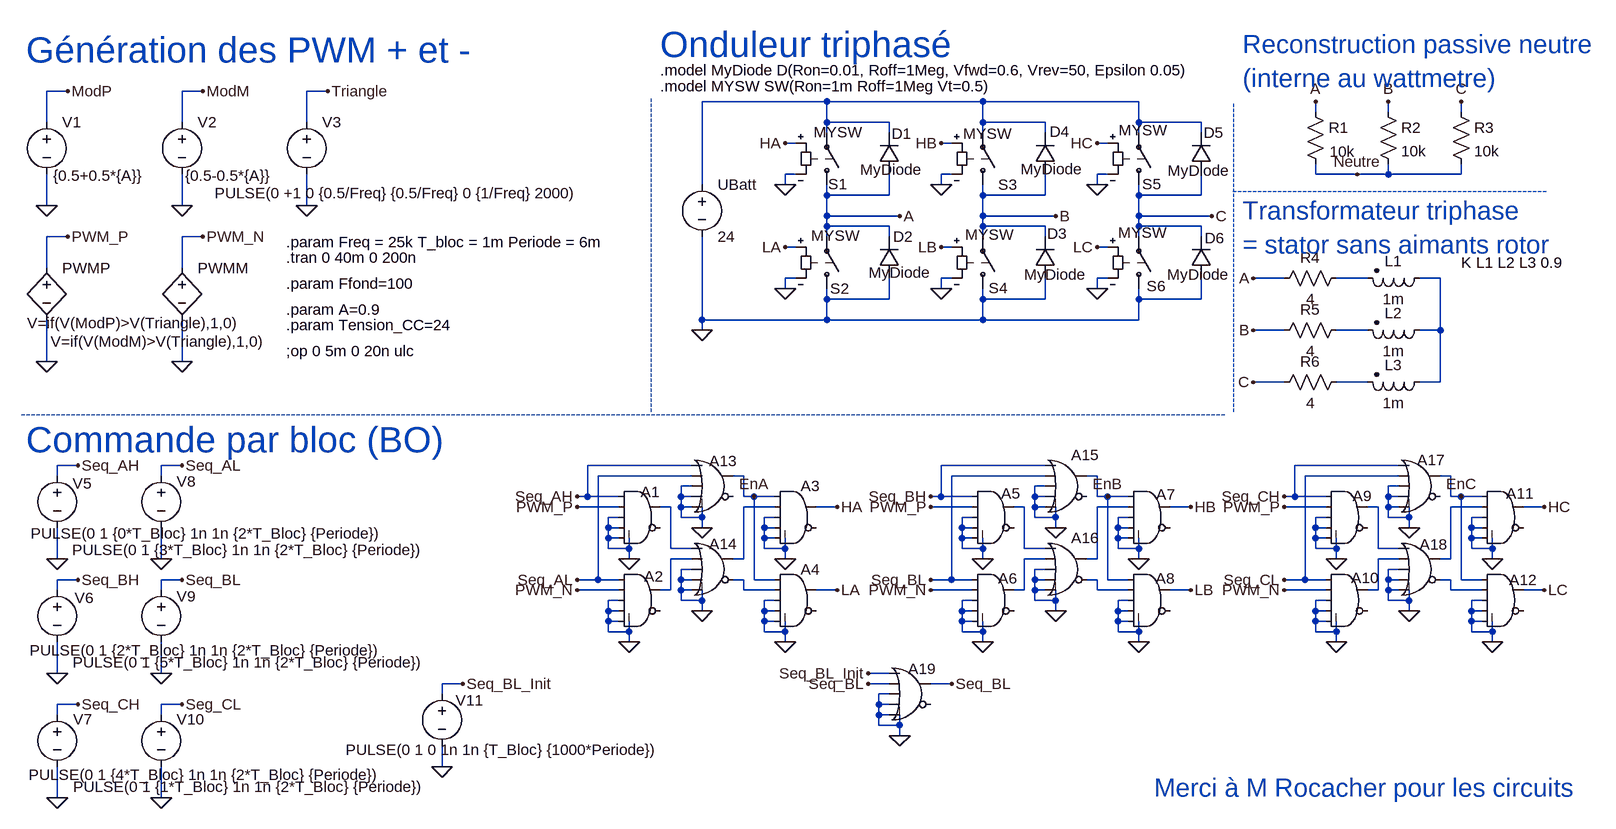
[diagram p0: schematic v1.asc]
v1.asc, the LTspice schematic file:
Version 4
SHEET 1 1408 1276
WIRE -1056 160 -1088 160
WIRE -848 160 -880 160
WIRE -656 160 -688 160
WIRE 112 176 -80 176
WIRE 352 176 112 176
WIRE 592 176 352 176
WIRE 864 192 864 176
WIRE 976 192 976 176
WIRE 1088 192 1088 176
WIRE -1088 208 -1088 160
WIRE -880 208 -880 160
WIRE -688 208 -688 160
WIRE 112 208 112 176
WIRE 208 208 112 208
WIRE 352 208 352 176
WIRE 448 208 352 208
WIRE 592 208 592 176
WIRE 688 208 592 208
WIRE 112 224 112 208
WIRE 208 224 208 208
WIRE 352 224 352 208
WIRE 448 224 448 208
WIRE 592 224 592 208
WIRE 688 224 688 208
WIRE 64 240 48 240
WIRE 304 240 288 240
WIRE 544 240 528 240
WIRE 64 288 48 288
WIRE 304 288 288 288
WIRE 544 288 528 288
WIRE 864 288 864 272
WIRE 928 288 864 288
WIRE 976 288 976 272
WIRE 976 288 928 288
WIRE 1088 288 1088 272
WIRE 1088 288 976 288
WIRE -80 304 -80 176
WIRE 48 304 48 288
WIRE 288 304 288 288
WIRE 528 304 528 288
WIRE 112 320 112 304
WIRE 208 320 208 288
WIRE 208 320 112 320
WIRE 352 320 352 304
WIRE 448 320 448 288
WIRE 448 320 352 320
WIRE 592 320 592 304
WIRE 688 320 688 288
WIRE 688 320 592 320
WIRE -1088 336 -1088 288
WIRE -880 336 -880 288
WIRE -688 336 -688 288
WIRE 112 352 112 320
WIRE 224 352 112 352
WIRE 352 352 352 320
WIRE 464 352 352 352
WIRE 592 352 592 320
WIRE 704 352 592 352
WIRE 112 368 112 352
WIRE 208 368 112 368
WIRE 352 368 352 352
WIRE 448 368 352 368
WIRE 592 368 592 352
WIRE 688 368 592 368
WIRE -1056 384 -1088 384
WIRE -848 384 -880 384
WIRE 112 384 112 368
WIRE 208 384 208 368
WIRE 352 384 352 368
WIRE 448 384 448 368
WIRE 592 384 592 368
WIRE 688 384 688 368
WIRE 64 400 48 400
WIRE 304 400 288 400
WIRE 544 400 528 400
WIRE -1088 432 -1088 384
WIRE -880 432 -880 384
WIRE 64 448 48 448
WIRE 304 448 288 448
WIRE 544 448 528 448
WIRE 816 448 768 448
WIRE 944 448 896 448
WIRE 1056 448 1024 448
WIRE 48 464 48 448
WIRE 288 464 288 448
WIRE 528 464 528 448
WIRE 112 480 112 464
WIRE 208 480 208 448
WIRE 208 480 112 480
WIRE 352 480 352 464
WIRE 448 480 448 448
WIRE 448 480 352 480
WIRE 592 480 592 464
WIRE 688 480 688 448
WIRE 688 480 592 480
WIRE -80 512 -80 384
WIRE 112 512 112 480
WIRE 112 512 -80 512
WIRE 352 512 352 480
WIRE 352 512 112 512
WIRE 592 512 592 480
WIRE 592 512 352 512
WIRE -80 528 -80 512
WIRE 816 528 768 528
WIRE 944 528 896 528
WIRE 1056 528 1056 448
WIRE 1056 528 1024 528
WIRE -1088 576 -1088 512
WIRE -880 576 -880 512
WIRE 816 608 768 608
WIRE 944 608 896 608
WIRE 1056 608 1056 528
WIRE 1056 608 1024 608
WIRE -1040 736 -1072 736
WIRE -880 736 -912 736
WIRE -96 736 -256 736
WIRE 448 736 288 736
WIRE 992 736 832 736
WIRE -1072 752 -1072 736
WIRE -912 752 -912 736
WIRE -96 752 -240 752
WIRE -16 752 -32 752
WIRE 448 752 304 752
WIRE 528 752 512 752
WIRE 992 752 848 752
WIRE 1072 752 1056 752
WIRE -96 768 -112 768
WIRE 448 768 432 768
WIRE 992 768 976 768
WIRE -256 784 -256 736
WIRE -256 784 -272 784
WIRE -208 784 -256 784
WIRE -112 784 -112 768
WIRE -96 784 -112 784
WIRE -16 784 -16 752
WIRE 0 784 -16 784
WIRE 32 784 0 784
WIRE 288 784 288 736
WIRE 288 784 272 784
WIRE 336 784 288 784
WIRE 432 784 432 768
WIRE 448 784 432 784
WIRE 528 784 528 752
WIRE 544 784 528 784
WIRE 576 784 544 784
WIRE 832 784 832 736
WIRE 832 784 816 784
WIRE 880 784 832 784
WIRE 976 784 976 768
WIRE 992 784 976 784
WIRE 1072 784 1072 752
WIRE 1088 784 1072 784
WIRE 1120 784 1088 784
WIRE -208 800 -272 800
WIRE -128 800 -144 800
WIRE -112 800 -112 784
WIRE -96 800 -112 800
WIRE 32 800 -16 800
WIRE 128 800 96 800
WIRE 336 800 272 800
WIRE 416 800 400 800
WIRE 432 800 432 784
WIRE 448 800 432 800
WIRE 576 800 528 800
WIRE 672 800 640 800
WIRE 880 800 816 800
WIRE 960 800 944 800
WIRE 976 800 976 784
WIRE 992 800 976 800
WIRE 1120 800 1072 800
WIRE 1216 800 1184 800
WIRE -208 816 -224 816
WIRE -112 816 -112 800
WIRE -80 816 -80 800
WIRE -80 816 -112 816
WIRE 32 816 16 816
WIRE 336 816 320 816
WIRE 432 816 432 800
WIRE 464 816 464 800
WIRE 464 816 432 816
WIRE 576 816 560 816
WIRE 880 816 864 816
WIRE 976 816 976 800
WIRE 1008 816 1008 800
WIRE 1008 816 976 816
WIRE 1120 816 1104 816
WIRE -224 832 -224 816
WIRE -208 832 -224 832
WIRE -80 832 -80 816
WIRE 16 832 16 816
WIRE 32 832 16 832
WIRE 320 832 320 816
WIRE 336 832 320 832
WIRE 464 832 464 816
WIRE 560 832 560 816
WIRE 576 832 560 832
WIRE 864 832 864 816
WIRE 880 832 864 832
WIRE 1008 832 1008 816
WIRE 1104 832 1104 816
WIRE 1120 832 1104 832
WIRE -224 848 -224 832
WIRE -208 848 -224 848
WIRE 16 848 16 832
WIRE 32 848 16 848
WIRE 320 848 320 832
WIRE 336 848 320 848
WIRE 560 848 560 832
WIRE 576 848 560 848
WIRE 864 848 864 832
WIRE 880 848 864 848
WIRE 1104 848 1104 832
WIRE 1120 848 1104 848
WIRE -224 864 -224 848
WIRE -192 864 -192 848
WIRE -192 864 -224 864
WIRE -128 864 -128 800
WIRE -96 864 -128 864
WIRE 16 864 16 848
WIRE 48 864 48 848
WIRE 48 864 16 864
WIRE 320 864 320 848
WIRE 352 864 352 848
WIRE 352 864 320 864
WIRE 416 864 416 800
WIRE 448 864 416 864
WIRE 560 864 560 848
WIRE 592 864 592 848
WIRE 592 864 560 864
WIRE 864 864 864 848
WIRE 896 864 896 848
WIRE 896 864 864 864
WIRE 960 864 960 800
WIRE 992 864 960 864
WIRE 1104 864 1104 848
WIRE 1136 864 1136 848
WIRE 1136 864 1104 864
WIRE -1072 880 -1072 832
WIRE -912 880 -912 832
WIRE -192 880 -192 864
WIRE -96 880 -128 880
WIRE -16 880 -16 800
WIRE -16 880 -32 880
WIRE 48 880 48 864
WIRE 352 880 352 864
WIRE 448 880 416 880
WIRE 528 880 528 800
WIRE 528 880 512 880
WIRE 592 880 592 864
WIRE 896 880 896 864
WIRE 992 880 960 880
WIRE 1072 880 1072 800
WIRE 1072 880 1056 880
WIRE 1136 880 1136 864
WIRE -96 896 -112 896
WIRE 448 896 432 896
WIRE 992 896 976 896
WIRE -1040 912 -1072 912
WIRE -880 912 -912 912
WIRE -240 912 -240 752
WIRE -240 912 -272 912
WIRE -208 912 -240 912
WIRE -112 912 -112 896
WIRE -96 912 -112 912
WIRE -16 912 -32 912
WIRE 0 912 0 784
WIRE 32 912 0 912
WIRE 304 912 304 752
WIRE 304 912 272 912
WIRE 336 912 304 912
WIRE 432 912 432 896
WIRE 448 912 432 912
WIRE 528 912 512 912
WIRE 544 912 544 784
WIRE 576 912 544 912
WIRE 848 912 848 752
WIRE 848 912 816 912
WIRE 880 912 848 912
WIRE 976 912 976 896
WIRE 992 912 976 912
WIRE 1072 912 1056 912
WIRE 1088 912 1088 784
WIRE 1120 912 1088 912
WIRE -1072 928 -1072 912
WIRE -912 928 -912 912
WIRE -208 928 -272 928
WIRE -128 928 -128 880
WIRE -128 928 -144 928
WIRE -112 928 -112 912
WIRE -96 928 -112 928
WIRE -16 928 -16 912
WIRE 32 928 -16 928
WIRE 128 928 96 928
WIRE 336 928 272 928
WIRE 416 928 416 880
WIRE 416 928 400 928
WIRE 432 928 432 912
WIRE 448 928 432 928
WIRE 528 928 528 912
WIRE 576 928 528 928
WIRE 672 928 640 928
WIRE 880 928 816 928
WIRE 960 928 960 880
WIRE 960 928 944 928
WIRE 976 928 976 912
WIRE 992 928 976 928
WIRE 1072 928 1072 912
WIRE 1120 928 1072 928
WIRE 1216 928 1184 928
WIRE -208 944 -224 944
WIRE -112 944 -112 928
WIRE -80 944 -80 928
WIRE -80 944 -112 944
WIRE 32 944 16 944
WIRE 336 944 320 944
WIRE 432 944 432 928
WIRE 464 944 464 928
WIRE 464 944 432 944
WIRE 576 944 560 944
WIRE 880 944 864 944
WIRE 976 944 976 928
WIRE 1008 944 1008 928
WIRE 1008 944 976 944
WIRE 1120 944 1104 944
WIRE -224 960 -224 944
WIRE -208 960 -224 960
WIRE -80 960 -80 944
WIRE 16 960 16 944
WIRE 32 960 16 960
WIRE 320 960 320 944
WIRE 336 960 320 960
WIRE 464 960 464 944
WIRE 560 960 560 944
WIRE 576 960 560 960
WIRE 864 960 864 944
WIRE 880 960 864 960
WIRE 1008 960 1008 944
WIRE 1104 960 1104 944
WIRE 1120 960 1104 960
WIRE -224 976 -224 960
WIRE -208 976 -224 976
WIRE 16 976 16 960
WIRE 32 976 16 976
WIRE 320 976 320 960
WIRE 336 976 320 976
WIRE 560 976 560 960
WIRE 576 976 560 976
WIRE 864 976 864 960
WIRE 880 976 864 976
WIRE 1104 976 1104 960
WIRE 1120 976 1104 976
WIRE -224 992 -224 976
WIRE -192 992 -192 976
WIRE -192 992 -224 992
WIRE 16 992 16 976
WIRE 48 992 48 976
WIRE 48 992 16 992
WIRE 320 992 320 976
WIRE 352 992 352 976
WIRE 352 992 320 992
WIRE 560 992 560 976
WIRE 592 992 592 976
WIRE 592 992 560 992
WIRE 864 992 864 976
WIRE 896 992 896 976
WIRE 896 992 864 992
WIRE 1104 992 1104 976
WIRE 1136 992 1136 976
WIRE 1136 992 1104 992
WIRE -192 1008 -192 992
WIRE 48 1008 48 992
WIRE 352 1008 352 992
WIRE 592 1008 592 992
WIRE 896 1008 896 992
WIRE 1136 1008 1136 992
WIRE -1072 1056 -1072 1008
WIRE -912 1056 -912 1008
WIRE 208 1056 176 1056
WIRE -448 1072 -480 1072
WIRE 208 1072 176 1072
WIRE 304 1072 272 1072
WIRE -480 1088 -480 1072
WIRE 208 1088 192 1088
WIRE -1040 1104 -1072 1104
WIRE -880 1104 -912 1104
WIRE 192 1104 192 1088
WIRE 208 1104 192 1104
WIRE -1072 1120 -1072 1104
WIRE -912 1120 -912 1104
WIRE 192 1120 192 1104
WIRE 208 1120 192 1120
WIRE 192 1136 192 1120
WIRE 224 1136 224 1120
WIRE 224 1136 192 1136
WIRE 224 1152 224 1136
WIRE -480 1200 -480 1168
WIRE -1072 1248 -1072 1200
WIRE -912 1248 -912 1200
FLAG -1088 336 0
FLAG -880 336 0
FLAG -688 336 0
FLAG -880 576 0
FLAG -1088 576 0
FLAG -1056 160 ModP
FLAG -848 160 ModM
FLAG -656 160 Triangle
FLAG -1056 384 PWM_P
FLAG -848 384 PWM_N
FLAG 48 304 0
FLAG 48 464 0
FLAG 288 304 0
FLAG 288 464 0
FLAG 528 464 0
FLAG 528 304 0
FLAG -80 528 0
FLAG 224 352 A
FLAG 464 352 B
FLAG 704 352 C
FLAG 48 240 HA
FLAG 288 240 HB
FLAG 528 240 HC
FLAG 48 400 LA
FLAG 288 400 LB
FLAG 528 400 LC
FLAG 864 176 A
FLAG 768 448 A
FLAG 976 176 B
FLAG 768 528 B
FLAG 1088 176 C
FLAG 768 608 C
FLAG 928 288 Neutre
FLAG -1040 736 Seq_AH
FLAG -272 784 Seq_AH
FLAG -880 736 Seq_AL
FLAG -912 880 0
FLAG -1072 880 0
FLAG 272 784 Seq_BH
FLAG -1040 912 Seq_BH
FLAG -272 912 Seq_AL
FLAG -880 912 Seq_BL
FLAG 272 912 Seq_BL
FLAG 176 1072 Seq_BL
FLAG 304 1072 Seq_BL
FLAG -912 1056 0
FLAG -1072 1056 0
FLAG -1040 1104 Seq_CH
FLAG 816 784 Seq_CH
FLAG -880 1104 Seg_CL
FLAG 816 912 Seg_CL
FLAG -1072 1248 0
FLAG -912 1248 0
FLAG -480 1200 0
FLAG -448 1072 Seq_BL_Init
FLAG 176 1056 Seq_BL_Init
FLAG -272 800 PWM_P
FLAG 272 800 PWM_P
FLAG 816 800 PWM_P
FLAG -272 928 PWM_N
FLAG 272 928 PWM_N
FLAG 816 928 PWM_N
FLAG -192 880 0
FLAG -192 1008 0
FLAG -80 832 0
FLAG -80 960 0
FLAG 48 880 0
FLAG 48 1008 0
FLAG 0 784 EnA
FLAG 128 800 HA
FLAG 128 928 LA
FLAG 352 1008 0
FLAG 352 880 0
FLAG 464 832 0
FLAG 464 960 0
FLAG 592 1008 0
FLAG 592 880 0
FLAG 544 784 EnB
FLAG 672 800 HB
FLAG 672 928 LB
FLAG 1216 800 HC
FLAG 1216 928 LC
FLAG 896 1008 0
FLAG 1008 960 0
FLAG 1136 1008 0
FLAG 1136 880 0
FLAG 1008 832 0
FLAG 896 880 0
FLAG 1088 784 EnC
FLAG 224 1152 0
SYMBOL voltage -1088 192 R0
WINDOW 3 10 98 Left 2
WINDOW 123 0 0 Left 0
WINDOW 39 0 0 Left 0
SYMATTR Value {0.5+0.5*{A}}
SYMATTR InstName V1
SYMBOL voltage -880 192 R0
WINDOW 3 5 98 Left 2
WINDOW 123 0 0 Left 0
WINDOW 39 0 0 Left 0
SYMATTR Value {0.5-0.5*{A}}
SYMATTR InstName V2
SYMBOL voltage -688 192 R0
WINDOW 3 -142 125 Left 2
WINDOW 123 0 0 Left 0
WINDOW 39 0 0 Left 0
SYMATTR Value PULSE(0 +1 0 {0.5/Freq} {0.5/Freq} 0 {1/Freq} 2000)
SYMATTR InstName V3
SYMBOL bv -1088 416 R0
WINDOW 3 -30 101 Left 2
SYMATTR Value V=if(V(ModP)>V(Triangle),1,0)
SYMATTR InstName PWMP
SYMBOL bv -880 416 R0
WINDOW 3 -202 129 Left 2
SYMATTR Value V=if(V(ModM)>V(Triangle),1,0)
SYMATTR InstName PWMM
SYMBOL sw 112 320 M180
WINDOW 0 2 17 Left 2
WINDOW 3 -20 97 Left 2
SYMATTR InstName S1
SYMATTR Value MYSW
SYMBOL sw 112 480 M180
WINDOW 0 5 16 Left 2
WINDOW 3 -24 98 Left 2
SYMATTR InstName S2
SYMATTR Value MYSW
SYMBOL sw 352 320 M180
WINDOW 3 -30 95 Left 2
SYMATTR Value MYSW
SYMATTR InstName S3
SYMBOL sw 352 480 M180
WINDOW 0 9 17 Left 2
WINDOW 3 -27 99 Left 2
SYMATTR InstName S4
SYMATTR Value MYSW
SYMBOL sw 592 320 M180
WINDOW 0 5 17 Left 2
WINDOW 3 -31 100 Left 2
SYMATTR InstName S5
SYMATTR Value MYSW
SYMBOL sw 592 480 M180
WINDOW 0 12 20 Left 2
WINDOW 3 -32 102 Left 2
SYMATTR InstName S6
SYMATTR Value MYSW
SYMBOL diode 224 288 R180
WINDOW 0 -19 63 Left 2
WINDOW 3 -35 7 Left 2
SYMATTR InstName D1
SYMATTR Value MyDiode
SYMBOL diode 224 448 R180
WINDOW 0 -21 64 Left 2
WINDOW 3 -48 9 Left 2
SYMATTR InstName D2
SYMATTR Value MyDiode
SYMBOL diode 464 448 R180
WINDOW 0 -18 69 Left 2
WINDOW 3 -47 6 Left 2
SYMATTR InstName D3
SYMATTR Value MyDiode
SYMBOL diode 464 288 R180
WINDOW 0 -22 66 Left 2
WINDOW 3 -42 8 Left 2
SYMATTR InstName D4
SYMATTR Value MyDiode
SYMBOL diode 704 288 R180
WINDOW 0 -19 64 Left 2
WINDOW 3 -28 6 Left 2
SYMATTR InstName D5
SYMATTR Value MyDiode
SYMBOL diode 704 448 R180
WINDOW 0 -20 62 Left 2
WINDOW 3 -27 6 Left 2
SYMATTR InstName D6
SYMATTR Value MyDiode
SYMBOL voltage -80 288 R0
SYMATTR InstName UBatt
SYMATTR Value 24
SYMBOL res 848 176 R0
WINDOW 3 38 77 Left 2
SYMATTR Value 10k
SYMATTR InstName R1
SYMBOL res 960 176 R0
SYMATTR InstName R2
SYMATTR Value 10k
SYMBOL res 1072 176 R0
SYMATTR InstName R3
SYMATTR Value 10k
SYMBOL res 912 432 R90
WINDOW 0 0 56 VBottom 2
WINDOW 3 32 56 VTop 2
SYMATTR InstName R4
SYMATTR Value 4
SYMBOL res 912 512 R90
WINDOW 0 0 56 VBottom 2
WINDOW 3 32 56 VTop 2
SYMATTR InstName R5
SYMATTR Value 4
SYMBOL res 912 592 R90
WINDOW 0 0 56 VBottom 2
WINDOW 3 32 56 VTop 2
SYMATTR InstName R6
SYMATTR Value 4
SYMBOL ind2 1040 432 R90
WINDOW 0 5 56 VBottom 2
WINDOW 3 32 56 VTop 2
SYMATTR InstName L1
SYMATTR Value 1m
SYMATTR Type ind
SYMBOL ind2 1040 512 R90
WINDOW 0 5 56 VBottom 2
WINDOW 3 32 56 VTop 2
SYMATTR InstName L2
SYMATTR Value 1m
SYMATTR Type ind
SYMBOL ind2 1040 592 R90
WINDOW 0 5 56 VBottom 2
WINDOW 3 32 56 VTop 2
SYMATTR InstName L3
SYMATTR Value 1m
SYMATTR Type ind
SYMBOL voltage -1072 736 R0
WINDOW 0 24 28 Left 2
WINDOW 3 -41 105 Left 2
SYMATTR InstName V5
SYMATTR Value PULSE(0 1 {0*T_Bloc} 1n 1n {2*T_Bloc} {Periode})
SYMBOL voltage -1072 912 R0
WINDOW 0 27 28 Left 2
WINDOW 3 -42 109 Left 2
SYMATTR InstName V6
SYMATTR Value PULSE(0 1 {2*T_Bloc} 1n 1n {2*T_Bloc} {Periode})
SYMBOL voltage -1072 1104 R0
WINDOW 0 25 23 Left 2
WINDOW 3 -44 108 Left 2
SYMATTR InstName V7
SYMATTR Value PULSE(0 1 {4*T_Bloc} 1n 1n {2*T_Bloc} {Periode})
SYMBOL voltage -912 736 R0
WINDOW 0 24 25 Left 2
WINDOW 3 -137 130 Left 2
SYMATTR InstName V8
SYMATTR Value PULSE(0 1 {3*T_Bloc} 1n 1n {2*T_Bloc} {Periode})
SYMBOL voltage -912 912 R0
WINDOW 0 24 26 Left 2
WINDOW 3 -136 127 Left 2
WINDOW 123 0 0 Left 0
WINDOW 39 0 0 Left 0
SYMATTR InstName V9
SYMATTR Value PULSE(0 1 {5*T_Bloc} 1n 1n {2*T_Bloc} {Periode})
SYMBOL voltage -912 1104 R0
WINDOW 0 24 23 Left 2
WINDOW 3 -135 127 Left 2
SYMATTR InstName V10
SYMATTR Value PULSE(0 1 {1*T_Bloc} 1n 1n {2*T_Bloc} {Periode})
SYMBOL voltage -480 1072 R0
WINDOW 0 21 26 Left 2
WINDOW 3 -148 102 Left 2
SYMATTR InstName V11
SYMATTR Value PULSE(0 1 0 1n 1n {T_Bloc} {1000*Periode})
SYMBOL Digital\\and -176 752 R0
WINDOW 0 2 25 Left 2
SYMATTR InstName A1
SYMBOL Digital\\and -176 880 R0
WINDOW 0 7 27 Left 2
SYMATTR InstName A2
SYMBOL Digital\\and 64 752 R0
SYMATTR InstName A3
SYMBOL Digital\\and 64 880 R0
SYMATTR InstName A4
SYMBOL Digital\\and 368 752 R0
WINDOW 0 12 27 Left 2
SYMATTR InstName A5
SYMBOL Digital\\and 368 880 R0
WINDOW 0 8 30 Left 2
SYMATTR InstName A6
SYMBOL Digital\\and 608 752 R0
WINDOW 0 11 29 Left 2
SYMATTR InstName A7
SYMBOL Digital\\and 608 880 R0
WINDOW 0 10 30 Left 2
SYMATTR InstName A8
SYMBOL Digital\\and 912 752 R0
WINDOW 0 9 31 Left 2
SYMATTR InstName A9
SYMBOL Digital\\and 912 880 R0
WINDOW 0 7 29 Left 2
SYMATTR InstName A10
SYMBOL Digital\\and 1152 752 R0
WINDOW 0 5 27 Left 2
SYMATTR InstName A11
SYMBOL Digital\\and 1152 880 R0
WINDOW 0 10 32 Left 2
SYMATTR InstName A12
SYMBOL Digital\\or -64 704 R0
WINDOW 0 -5 25 Left 2
SYMATTR InstName A13
SYMBOL Digital\\or -64 832 R0
WINDOW 0 -5 25 Left 2
SYMATTR InstName A14
SYMBOL Digital\\or 480 704 R0
SYMATTR InstName A15
SYMBOL Digital\\or 480 832 R0
SYMATTR InstName A16
SYMBOL Digital\\or 1024 704 R0
WINDOW 0 -4 24 Left 2
SYMATTR InstName A17
SYMBOL Digital\\or 1024 832 R0
WINDOW 0 0 26 Left 2
SYMATTR InstName A18
SYMBOL Digital\\or 240 1024 R0
WINDOW 0 -3 25 Left 2
SYMATTR InstName A19
TEXT -1120 96 Left 5 ;Génération des PWM + et -
TEXT -720 392 Left 2 !.param Freq = 25k T_bloc = 1m Periode = 6m
TEXT -720 416 Left 2 !.tran 0 40m 0 200n
TEXT -720 456 Left 2 !.param Ffond=100
TEXT -720 496 Left 2 !.param A=0.9
TEXT -720 520 Left 2 !.param Tension_CC=24
TEXT -720 560 Left 2 !;op 0 5m 0 20n ulc
TEXT -160 656 VLeft 2 ;---------------------------------------------------------------
TEXT -144 88 Left 5 ;Onduleur triphasé
TEXT -144 128 Left 2 !.model MyDiode D(Ron=0.01, Roff=1Meg, Vfwd=0.6, Vrev=50, Epsilon 0.05)
TEXT -144 152 Left 2 !.model MYSW SW(Ron=1m Roff=1Meg Vt=0.5)
TEXT 736 656 VLeft 2 ;--------------------------------------------------------------
TEXT 752 88 Left 4 ;Reconstruction passive neutre\n(interne au wattmetre)
TEXT 752 344 Left 4 ;Transformateur triphase\n= stator sans aimants rotor
TEXT 736 312 Left 2 ;---------------------------------------------------------------
TEXT 1088 424 Left 2 !K L1 L2 L3 0.9
TEXT -1128 656 Left 2 ;-------------------------------------------------------------------------------------------------------------------------------------------------------------------------------------------------------------------------------------------------
TEXT -1120 696 Left 5 ;Commande par bloc (BO)
TEXT 616 1232 Left 4 ;Merci à M Rocacher pour les circuits

The netlist it stands for:
* v1.asc
V1 ModP 0 {0.5+0.5*{A}}
V2 ModM 0 {0.5-0.5*{A}}
V3 Triangle 0 PULSE(0 +1 0 {0.5/Freq} {0.5/Freq} 0 {1/Freq} 2000)
B§PWMP PWM_P 0 V=if(V(ModP)>V(Triangle),1,0)
B§PWMM PWM_N 0 V=if(V(ModM)>V(Triangle),1,0)
S1 A N001 HA 0 MYSW
S2 0 A LA 0 MYSW
S3 B N001 HB 0 MYSW
S4 0 B LB 0 MYSW
S5 C N001 HC 0 MYSW
S6 0 C LC 0 MYSW
D1 A N001 MyDiode
D2 0 A MyDiode
D3 0 B MyDiode
D4 B N001 MyDiode
D5 C N001 MyDiode
D6 0 C MyDiode
V§UBatt N001 0 24
R1 A Neutre 10k
R2 B Neutre 10k
R3 C Neutre 10k
R4 N002 A 4
R5 N004 B 4
R6 N005 C 4
L1 N003 N002 1m
L2 N003 N004 1m
L3 N003 N005 1m
V5 Seq_AH 0 PULSE(0 1 {0*T_Bloc} 1n 1n {2*T_Bloc} {Periode})
V6 Seq_BH 0 PULSE(0 1 {2*T_Bloc} 1n 1n {2*T_Bloc} {Periode})
V7 Seq_CH 0 PULSE(0 1 {4*T_Bloc} 1n 1n {2*T_Bloc} {Periode})
V8 Seq_AL 0 PULSE(0 1 {3*T_Bloc} 1n 1n {2*T_Bloc} {Periode})
V9 Seq_BL 0 PULSE(0 1 {5*T_Bloc} 1n 1n {2*T_Bloc} {Periode})
V10 Seg_CL 0 PULSE(0 1 {1*T_Bloc} 1n 1n {2*T_Bloc} {Periode})
V11 Seq_BL_Init 0 PULSE(0 1 0 1n 1n {T_Bloc} {1000*Periode})
A1 Seq_AH PWM_P 0 0 0 0 N006 0 AND
A2 Seq_AL PWM_N 0 0 0 0 N012 0 AND
A3 EnA N007 0 0 0 0 HA 0 AND
A4 EnA N015 0 0 0 0 LA 0 AND
A5 Seq_BH PWM_P 0 0 0 0 N008 0 AND
A6 Seq_BL PWM_N 0 0 0 0 N013 0 AND
A7 EnB N009 0 0 0 0 HB 0 AND
A8 EnB N016 0 0 0 0 LB 0 AND
A9 Seq_CH PWM_P 0 0 0 0 N010 0 AND
A10 Seg_CL PWM_N 0 0 0 0 N014 0 AND
A11 EnC N011 0 0 0 0 HC 0 AND
A12 EnC N017 0 0 0 0 LC 0 AND
A13 Seq_AH Seq_AL 0 0 0 0 EnA 0 OR
A14 N006 N012 0 0 0 N015 N007 0 OR
A15 Seq_BH Seq_BL 0 0 0 0 EnB 0 OR
A16 N008 N013 0 0 0 N016 N009 0 OR
A17 Seq_CH Seg_CL 0 0 0 0 EnC 0 OR
A18 N010 N014 0 0 0 N017 N011 0 OR
A19 Seq_BL_Init Seq_BL 0 0 0 0 Seq_BL 0 OR
.model D D
.lib standard.dio
* Génération des PWM + et -
.param Freq = 25k T_bloc = 1m Periode = 6m
.tran 0 40m 0 200n
.param Ffond=100
.param A=0.9
.param Tension_CC=24
;op 0 5m 0 20n ulc
* ---------------------------------------------------------------
* Onduleur triphasé
.model MyDiode D(Ron=0.01, Roff=1Meg, Vfwd=0.6, Vrev=50, Epsilon 0.05)
.model MYSW SW(Ron=1m Roff=1Meg Vt=0.5)
* --------------------------------------------------------------
* Reconstruction passive neutre
* (interne au wattmetre)
* Transformateur triphase
* = stator sans aimants rotor
* ---------------------------------------------------------------
K L1 L2 L3 0.9
* -------------------------------------------------------------------------------------------------------------------------------------------------------------------------------------------------------------------------------------------------
* Commande par bloc (BO)
* Merci à M Rocacher pour les circuits
.backanno
.end